# EAGLE schematic Schematic_v14 (EAGLE 9.7.0)
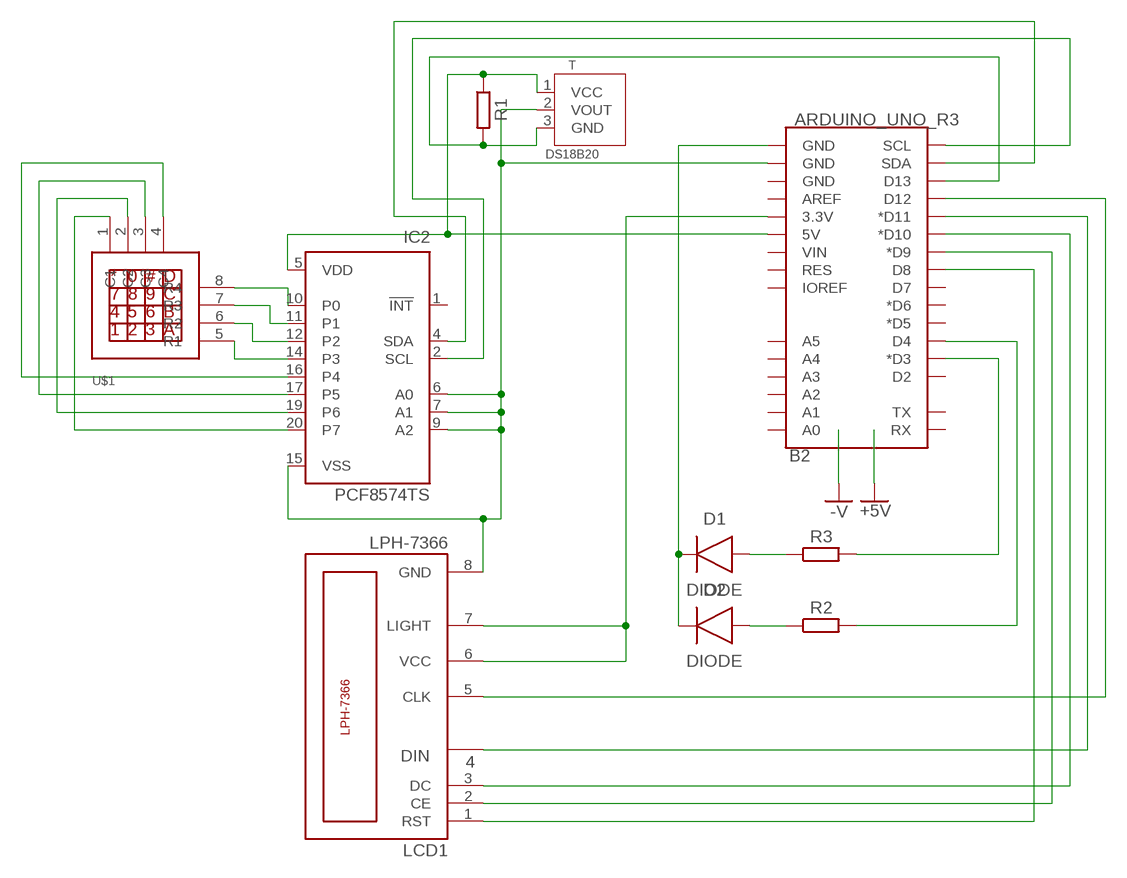
[diagram p0: schematic, sheet 1]

## Parts
B2  ARDUINO_UNO_R3  ARDUINO_UNO_R3_SHIELDUNO_R3_SHIELD_NOLABELS_LOCK  [UNO_R3_SHIELD_NOLABELS_LOCK]
D1  DIODE  DIODEDO-214AB(SMC)  [DIOM7959X625N]
D2  DIODE  DIODEDO-214AB(SMC)  [DIOM7959X625N]
IC2  PCF8574TS  [SSOP20]
LCD1  LPH-7366  [LPH-7366]
R1  R_AXIAL-7.2MM-PITCH  [RESAD724W46L381D178B]
R2  R_AXIAL-7.2MM-PITCH  [RESAD724W46L381D178B]
R3  R_AXIAL-7.2MM-PITCH  [RESAD724W46L381D178B]
T  DS18B20  A1324LLHLT-TLH  [SOT95P285X113-3N]
U$1  KEYPAD4X4  [KEYPAD4X4]

## Nets
N$1: B2.5V IC2.5(VDD) R1.1 T.1(VCC)
N$2: B2.D13 R1.2 T.3(GND)
N$3: D1.2(A) R3.1
N$4: B2.D3(*D3) R3.2
N$5: B2.D4 R2.2
N$6: D2.2(A) R2.1
N$7: B2.GND@0(GND) D1.1(C) D2.1(C)
N$8: IC2.10(P0) U$1.8(R4)
N$9: B2.GND@1(GND) IC2.6(A0) IC2.7(A1) IC2.9(A2) IC2.15(VSS) LCD1.8(GND) T.2(VOUT)
N$10: B2.SCL IC2.2(SCL)
N$11: IC2.11(P1) U$1.7(R3)
N$12: IC2.12(P2) U$1.6(R2)
N$13: IC2.14(P3) U$1.5(R1)
N$15: IC2.20(P7) U$1.1(C1)
N$16: IC2.19(P6) U$1.2(C2)
N$17: IC2.17(P5) U$1.3(C3)
N$18: IC2.16(P4) U$1.4(C4)
N$19: B2.SDA IC2.4(SDA)
N$20: B2.D8 LCD1.1(RST)
N$21: B2.D9(*D9) LCD1.2(CE)
N$22: B2.D10(*D10) LCD1.3(DC)
N$23: B2.D11(*D11) LCD1.4(DIN)
N$24: B2.D12 LCD1.5(CLK)
N$25: B2.3.3V LCD1.6(VCC) LCD1.7(LIGHT)
Unconnected: B2.A0 B2.A1 B2.A2 B2.A3 B2.A4 B2.A5 B2.AREF B2.D2 B2.D5(*D5) B2.D6(*D6) B2.D7 B2.GND@2(GND) B2.IOREF B2.RES B2.RX B2.TX B2.VIN IC2.1(!INT)

## Notes on the sheet
- 4

## Library data of the parts
B2 = SparkFun-Boards:ARDUINO_UNO_R3_SHIELD: Arduino R3 Shield Footprint Shield form compatible with the Arduino Uno R3. SparkFun Products: MG2639 Cellular Shield <https://www.sparkfun.com/products/13120> MIDI Shield <https://www.sparkfun.com/products/12898> R3 Stackable Headers Kit <https://www.sparkfun.com/products/11417>
D1 D2 = Diode:DIODE: Diode Rectifier - Generic; CATEGORY: Diode; SUB-CATEGORY: Rectifier
IC2 = micro-philips (1):PCF8574: I2C-Bus Remote 8-bit I/O expander http://www.semiconductors.philips.com/acrobat_download/datasheets/PCF8574_4.pdf
LCD1 = lph-7366:LPH-7366
R1-R3 = Resistor:R: Resistor Fixed - Generic; CATEGORY: Resistor; SUB-CATEGORY: Fixed
T = Sensor:A1324LLHLT-T: SENSOR HALL EFFECT ANALOG SOT23W; CATEGORY: Sensor; MANUFACTURER: Allegro microsystems; MPN: DS18B20; OPERATING_TEMP: -40 to 150 °C; PART_STATUS: Active; ROHS_COMPLIANT: RoHS3 Compliant; SUB-CATEGORY: Magnetic; VALUE: A1324LLHLT
U$1 = keypad_4x4_raw:KEYPAD4X4